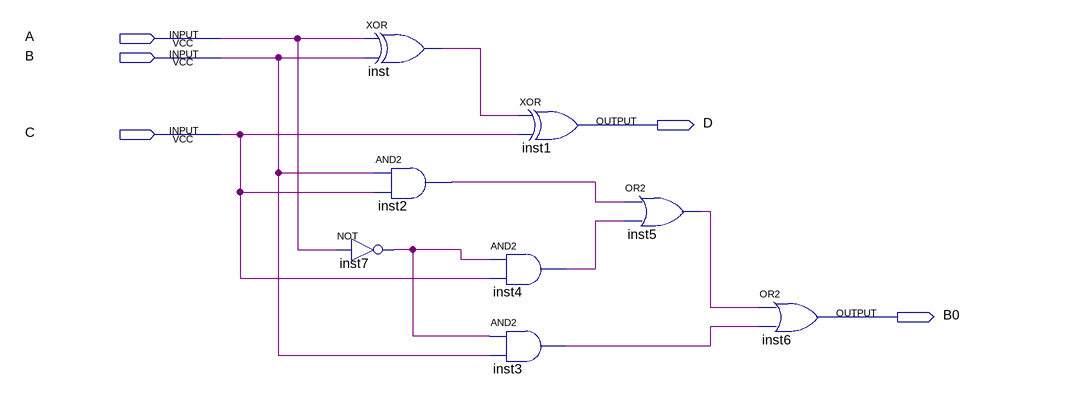
[diagram p0: schematic sheet]
// Quartus schematic Full_Subtractor.bdf as structural Verilog: 8 symbols, 5 pins
module Full_Subtractor (
  input  A,
  input  B,
  input  C,
  output D,
  output B0
);

  wire inst2_out, inst3_out, inst4_out, inst5_out, inst7_out, inst_out;

  not inst7 (inst7_out, A);
  xor inst (inst_out, A, B);
  and inst2 (inst2_out, B, C);
  and inst4 (inst4_out, inst7_out, C);
  and inst3 (inst3_out, inst7_out, B);
  xor inst1 (D, inst_out, C);
  or inst5 (inst5_out, inst2_out, inst4_out);
  or inst6 (B0, inst5_out, inst3_out);
endmodule
